# EAGLE design CompPhysMP_V1.0.1 (EAGLE 9.6.2)
2018-03-09: added 4 GPIO block and extender connector
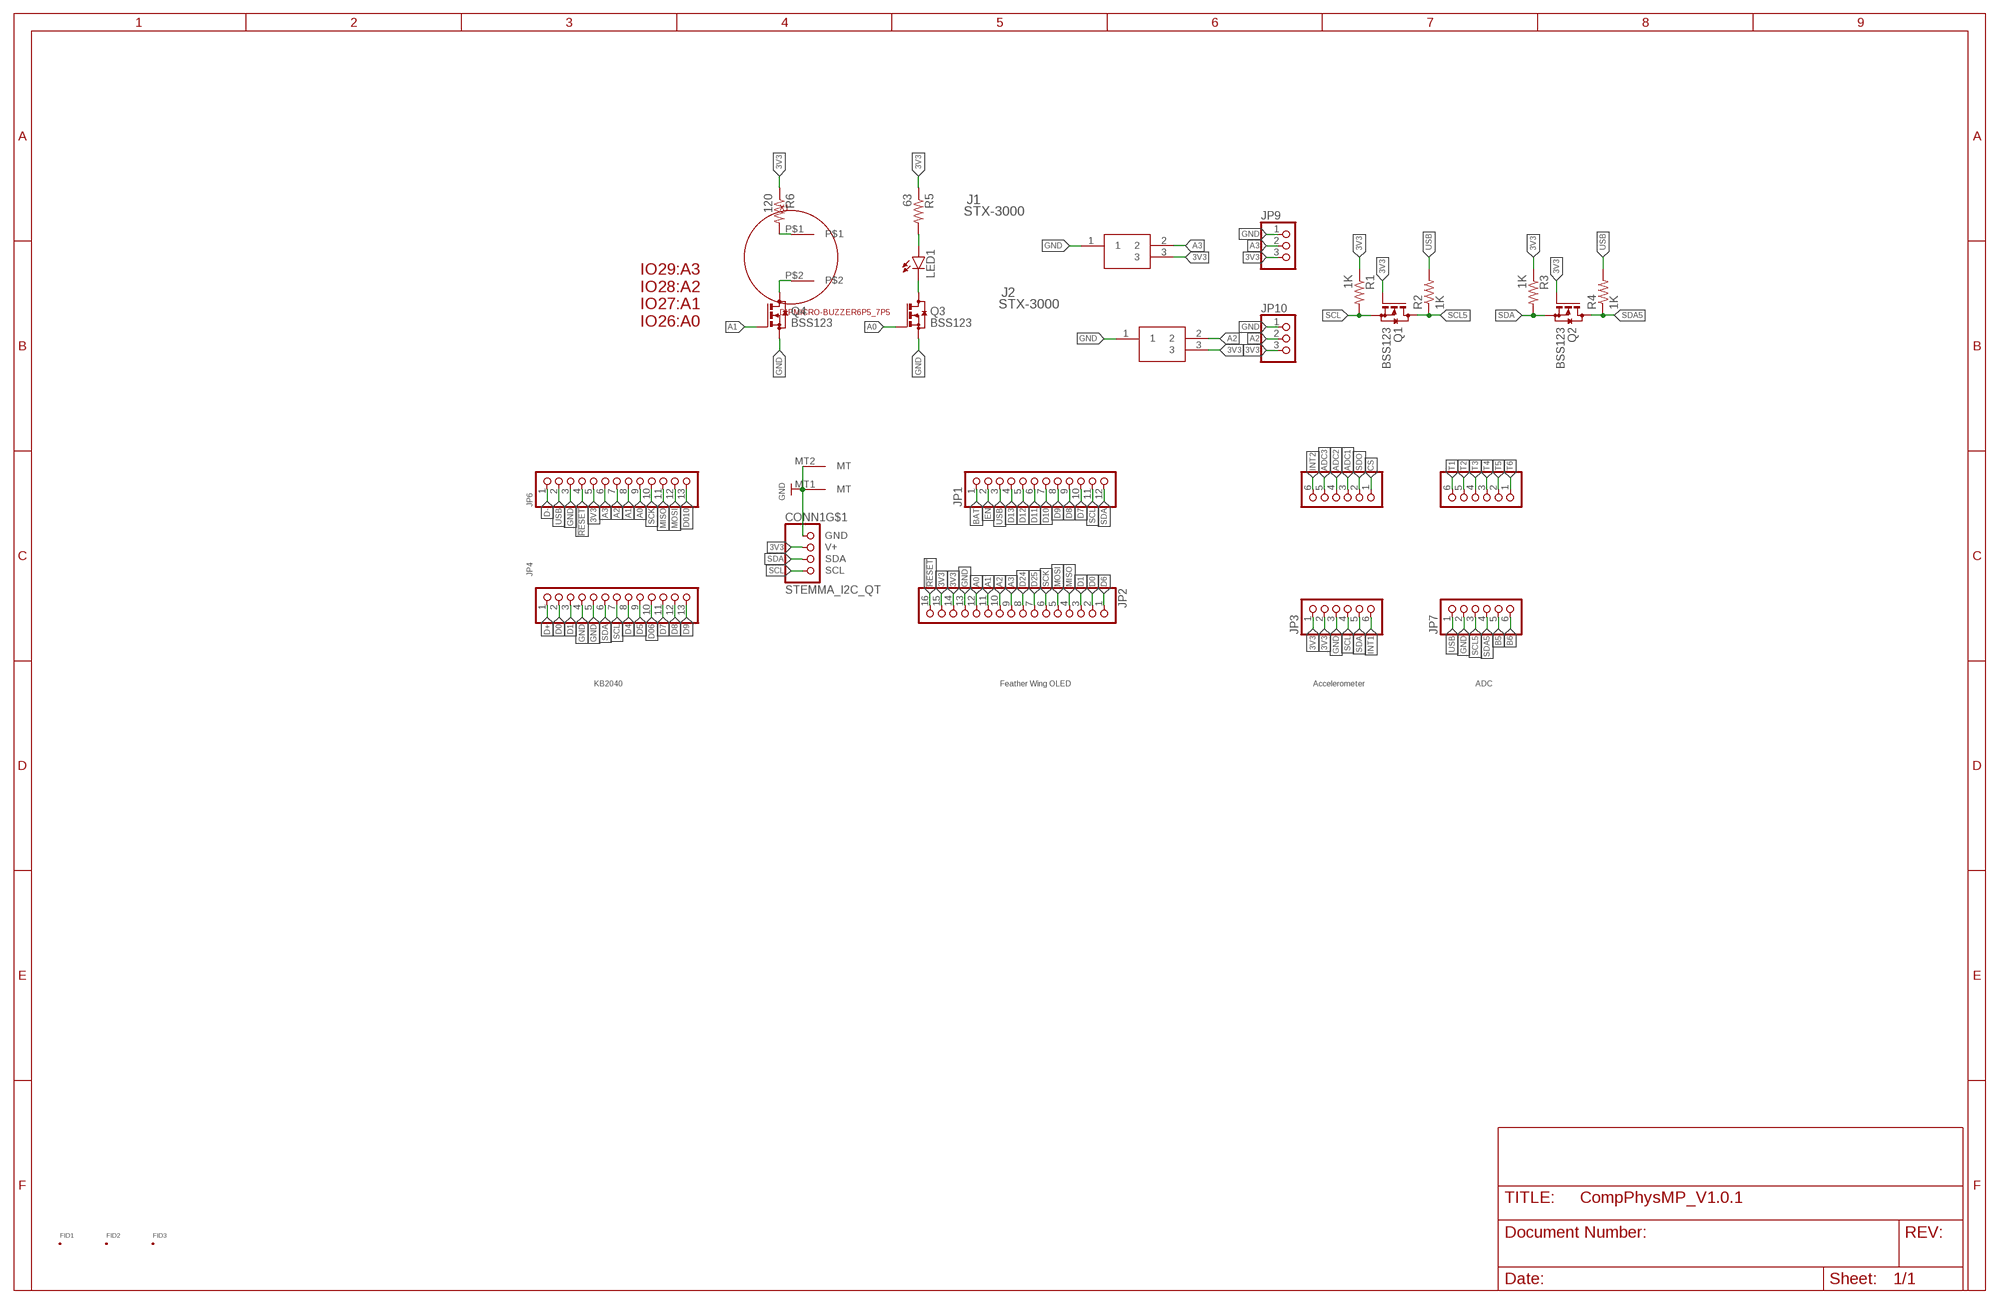
[diagram p0: schematic, sheet 1]

## Parts
CONN1  STEMMA_I2C_QT  [JST_SH4]
FID1  FID_50MIL  [FID_050]
FID2  FID_50MIL  [FID_050]
FID3  FID_50MIL  [FID_050]
J1  STX-3000  [STX3000]
J2  STX-3000  [STX3000]
JP1  PINHD-1X12  [1X12]
JP2  PINHD-1X16  [1X16]
JP3  HEADER-1X670MIL  [1X06_ROUND_70]
JP4  PINHD-1X13  [1X13]
JP5  HEADER-1X670MIL  [1X06_ROUND_70]
JP6  PINHD-1X13  [1X13]
JP7  HEADER-1X670MIL  [1X06_ROUND_70]
JP8  HEADER-1X670MIL  [1X06_ROUND_70]
JP9  PINHD-1X3SMALL-PADS  [1X03-BIG]
JP10  PINHD-1X3SMALL-PADS  [1X03-BIG]
LED1  LED5MM  [LED5MM]
Q1  BSS123  [SOT23]
Q2  BSS123  [SOT23]
Q3  BSS123  [SOT23]
Q4  BSS123  [SOT23]
R1  1K  R-US_R0805  [R0805]
R2  1K  R-US_R0805  [R0805]
R3  1K  R-US_R0805  [R0805]
R4  1K  R-US_R0805  [R0805]
R5  63  R-US_R0805  [R0805]
R6  120  R-US_R0805  [R0805]
X1  DIPMICRO-BUZZER6P5_7P5  [BUZZER-6P5-7P5]

## Nets
3V3 [power]: CONN1.2(V+) J1.3 J2.3 JP2.14 JP2.15 JP3.1 JP3.2 JP6.5 JP9.3 JP10.3 Q1.1(G) Q2.1(G) R1.1 R3.1 R5.1 R6.1
!RESET: JP2.16 JP6.4
A0: JP2.12 JP6.9 Q3.1(G)
A1: JP2.11 JP6.8 Q4.1(G)
A2: J2.2 JP2.10 JP6.7 JP10.2
A3: J1.2 JP2.9 JP6.6 JP9.2
ADC1: JP5.3
ADC2: JP5.4
ADC3: JP5.5
B5: JP7.5
B6: JP7.6
BAT: JP1.1
CS: JP5.1
D0: JP2.2 JP4.2
D1: JP2.3 JP4.3
D4: JP4.8
D5: JP4.9
D6: JP2.1
D06: JP4.10
D7: JP1.10 JP4.11
D8: JP1.9 JP4.12
D9: JP1.8 JP4.13
D10: JP1.7
D010: JP6.13
D11: JP1.6
D12: JP1.5
D13: JP1.4
D24: JP2.8
D25: JP2.7
D+: JP4.1
D-: JP6.1
EN: JP1.2
GND [power]: CONN1.1(GND) CONN1.MT1(MT) CONN1.MT2(MT) J1.1 J2.1 JP2.13 JP3.3 JP4.4 JP4.5 JP6.3 JP7.2 JP9.1 JP10.1 Q3.2(S) Q4.2(S)
INT1: JP3.6
INT2: JP5.6
MISO: JP2.4 JP6.11
MOSI: JP2.5 JP6.12
N$1: LED1.A R5.2
N$2: R6.2 X1.P$1
N$3: LED1.K(C) Q3.3(D)
N$4: Q4.3(D) X1.P$2
SCK: JP2.6 JP6.10
SCL: CONN1.4(SCL) JP1.11 JP3.4 JP4.7 Q1.2(S) R1.2
SCL5: JP7.3 Q1.3(D) R2.1
SDA: CONN1.3(SDA) JP1.12 JP3.5 JP4.6 Q2.2(S) R3.2
SDA5: JP7.4 Q2.3(D) R4.1
SDO: JP5.2
T1: JP8.6
T2: JP8.5
T3: JP8.4
T4: JP8.3
T5: JP8.2
T6: JP8.1
USB: JP1.3 JP6.2 JP7.1 R2.2 R4.2

## Notes on the sheet
- IO29:A3
  IO28:A2
  IO27:A1
  IO26:A0
- KB2040 | Feather Wing OLED | Accelerometer | ADC

## Library data of the parts
CONN1 = microbuilder:STEMMA_I2C
FID1-FID3 = Fiducial:FID: Fiducial marks. Top and Bottom copper with stop mask
J1 J2 = SamacSys_Parts:STX-3000: Phone Connectors 3.5mm PCB STEREO BLK PLASTIC NON THREADED Source: Datasheet <http://www.kycon.com/Pub_Eng_Draw/STX-3000.pdf>; DESCRIPTION: Phone Connectors 3.5mm PCB STEREO BLK PLASTIC NON THREADED; HEIGHT: mm; MANUFACTURER_NAME: Kycon; MANUFACTURER_PART_NUMBER: STX-3000; MOUSER_PART_NUMBER: 806-STX-3000; MOUSER_PRICE-STOCK: https://www.mouser.co.uk/ProductDetail/Kycon/STX-3000?qs=kjZ2mQLP346Nbz1X9BOzfg%3D%3D
JP1 = pinhead:PINHD-1X12: PIN HEADER
JP2 = pinhead:PINHD-1X16: PIN HEADER
JP3 JP5 JP7 JP8 = microbuilder:HEADER-1X6: PIN HEADER
JP4 JP6 = pinhead:PINHD-1X13: PIN HEADER
JP9 JP10 = ICs-new:PINHD-1X3: PIN HEADER
LED1 = led:LED: LED OSRAM: - CHIPLED LG R971, LG N971, LY N971, LG Q971, LY Q971, LO R971, LY R971 LH N974, LH R974 LS Q976, LO Q976, LY Q976 LO Q996 - Hyper CHIPLED LW Q18S LB Q993, LB Q99A, LB R99A - SideLED LS A670, LO A670, LY A670, LG A670, LP A670 LB A673, LV A673, LT A673, LW A673 LH A674 LY A675 LS A676, LA A676, LO A676, LY A676, LW A676 LS A679, LY A679, LG A679 - Hyper Micro SIDELED® LS Y876, LA Y876, LO Y876, LY Y876 LT Y87S - SmartLED LW L88C, LW L88S LB L89C, LB L89S, LG L890 LS L89K, LO L89K, LY L89K LS L896, LA L896, LO L896, LY L896 - TOPLED LS T670, LO T670, LY T670, LG T670, LP T670 LSG T670, LSP T670, LSY T670, LOP T670, LYG T670 LG T671, LOG T671, LSG T671 LB T673, LV T673, LT T673, LW T673 LH T674 LS T676, LA T676, LO T676, LY T676, LB T676, LH T676, LSB T676, LW T676 LB T67C, LV T67C, LT T67C, LS T67K, LO T67K, LY T67K, LW E67C LS E67B, LA E67B, LO E67B, LY E67B, LB E67C, LV E67C, LT E67C LW T67C LS T679, LY T679, LG T679 LS T770, LO T770, LY T770, LG T770, LP T770 LB T773, LV T773, LT T773, LW T773 LH T774 LS E675, LA E675, LY E675, LS T675 LS T776, LA T776, LO T776, LY T776, LB T776 LHGB T686 LT T68C, LB T68C - Hyper Mini TOPLED® LB M676 - Mini TOPLED Santana® LG M470 LS M47K, LO M47K, LY M47K Source: http://www.osram.convergy.de LUXEON: - LUMILED® LXK2-PW12-R00, LXK2-PW12-S00, LXK2-PW14-U00, LXK2-PW14-V00 LXK2-PM12-R00, LXK2-PM12-S00, LXK2-PM14-U00 LXK2-PE12-Q00, LXK2-PE12-R00, LXK2-PE12-S00, LXK2-PE14-T00, LXK2-PE14-U00 LXK2-PB12-K00, LXK2-PB12-L00, LXK2-PB12-M00, LXK2-PB14-N00, LXK2-PB14-P00, LXK2-PB14-Q00 LXK2-PR12-L00, LXK2-PR12-M00, LXK2-PR14-Q00, LXK2-PR14-R00 LXK2-PD12-Q00, LXK2-PD12-R00, LXK2-PD12-S00 LXK2-PH12-R00, LXK2-PH12-S00 LXK2-PL12-P00, LXK2-PL12-Q00, LXK2-PL12-R00 Source: www.luxeon.com KINGBRIGHT: KA-3528ASYC Source: www.kingbright.com
Q1-Q4 = transistor-small-signal:BSS123: N-CHANNEL MOS FET
R1-R6 = rcl:R-US_: RESISTOR, American symbol; SPICEPREFIX: R
X1 = ICs-new:DIPMICRO-BUZZER

## Net classes
0 default: width 0.152 mm, drill 0.203 mm, clearance 0.127 mm
1 power: width 0.305 mm, drill 0.254 mm, clearance 0.127 mm
2 lowpower: width 0.305 mm, drill 0.483 mm

## Board
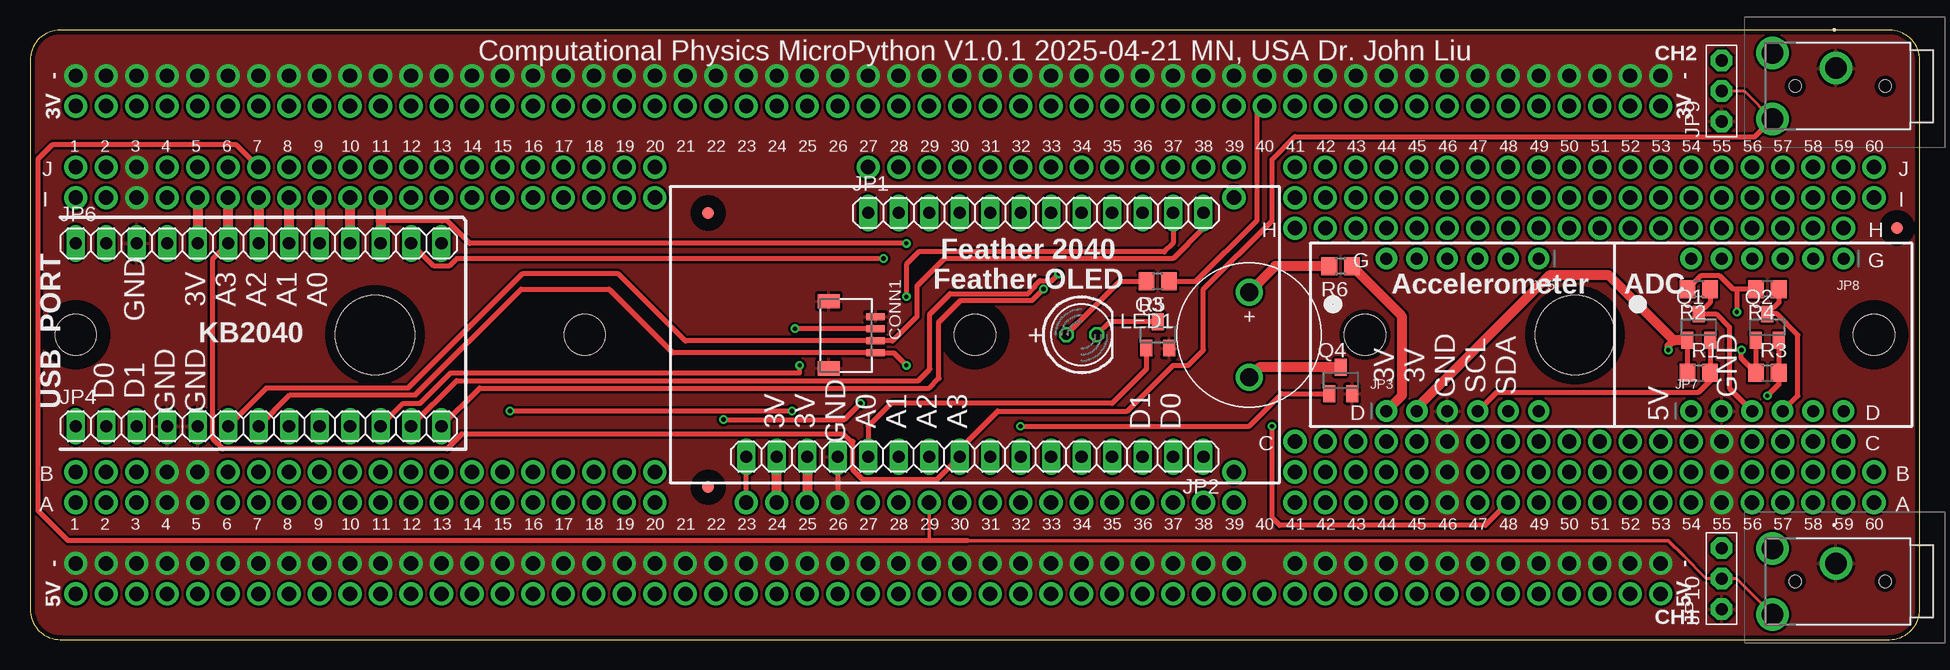
[diagram p1: board, top side]
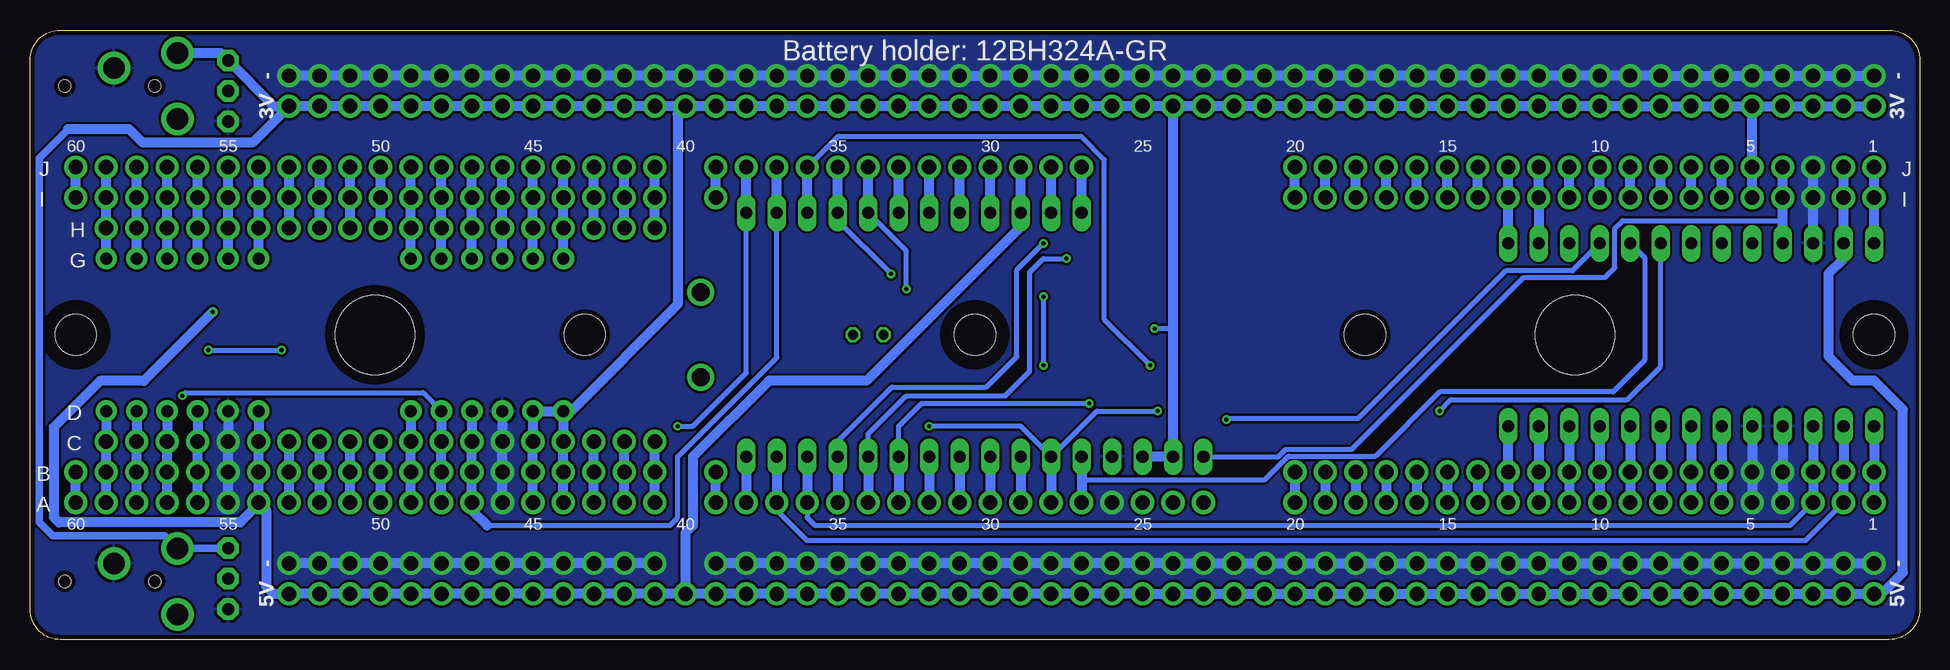
[diagram p2: board, bottom side, seen from below]

Size 157.48 x 50.8 mm. Coordinates in mm from the lower left corner, seen from the top.
Outline: 2.54,50.8 arc90 0,48.26 0,2.54 arc90 2.54,0 154.94,0 arc90 157.48,2.54 157.48,48.26 arc90 154.94,50.8 2.54,50.8
Copper layers (1*16): Top 0.0356mm / dielectric 1.5011mm / Bottom 0.0356mm
Design rules "LaenPCBOrder": minimum track width 6mil, minimum drill 13mil, track to track 6mil, track to pad 6mil, pad to pad 6mil, via to via 6mil, smd to smd 6mil, copper to edge 15mil, drill to drill 6mil, minimum pad ring 7mil, minimum via ring 7mil, stop-mask expansion 3mil, vias tented up to drill 0mil, thermal gap 10mil
Holes 3.43 mm at 3.81,25.4 153.67,25.4 78.74,25.4 111.25,25.4 46.23,25.4
Holes 6.6 mm at 128.74,25.4 28.74,25.4
tRestrict: area 1.3,22.9 to 6.3,27.9; area 151.1,22.9 to 156.2,27.9; area 76.2,22.9 to 81.3,27.9; area 124.9,21.6 to 132.5,29.2; area 24.9,21.6 to 32.6,29.2
bRestrict: area 151.1,22.9 to 156.2,27.9; area 1.3,22.9 to 6.3,27.9; area 76.2,22.9 to 81.3,27.9; area 124.9,21.6 to 132.5,29.2; area 24.9,21.6 to 32.6,29.2

### Footprints (pad centres in the part's own frame; a part is rotated, then mirrored left to right if it is on the bottom)
JST_SH4 = smd 0.6 x 1.55: 1 -1.5,2.514; 2 -0.5,2.514; 3 0.5,2.514; 4 1.5,2.514 | smd 1.2 x 1.8: MT1 -2.8,-1.386; MT2 2.8,-1.386
FID_050 = smd 1.016 x 1.016: FIDT 0,0
STX3000 = drill 1.803 pad 2.704: 1 0,0; 2 5.3,4.25; 3 5.3,-1.25 | hole 1: -4.1,1.5; 3.4,1.5
1X12 = drill 1.016 long: 1 -13.97,0; 2 -11.43,0; 3 -8.89,0; 4 -6.35,0; 5 -3.81,0; 6 -1.27,0; 7 1.27,0; 8 3.81,0; 9 6.35,0; 10 8.89,0; 11 11.43,0; 12 13.97,0
1X16 = drill 1.016 long: 1 -19.05,0; 2 -16.51,0; 3 -13.97,0; 4 -11.43,0; 5 -8.89,0; 6 -6.35,0; 7 -3.81,0; 8 -1.27,0; 9 1.27,0; 10 3.81,0; 11 6.35,0; 12 8.89,0; 13 11.43,0; 14 13.97,0; 15 16.51,0; 16 19.05,0
1X06_ROUND_70 = drill 1 pad 1.778: 1 -6.35,0; 2 -3.81,0; 3 -1.27,0; 4 1.27,0; 5 3.81,0; 6 6.35,0
1X13 = drill 1.016 long: 1 -15.24,0; 2 -12.7,0; 3 -10.16,0; 4 -7.62,0; 5 -5.08,0; 6 -2.54,0; 7 0,0; 8 2.54,0; 9 5.08,0; 10 7.62,0; 11 10.16,0; 12 12.7,0; 13 15.24,0
1X03-BIG = drill 1.016 pad 1.778 octagon: 1 -2.54,0; 2 0,0; 3 2.54,0
LED5MM = drill 0.813 octagon: A -1.27,0; K 1.27,0
SOT23 = smd 1 x 1.4: 1 -0.95,-1.1; 2 0.95,-1.1; 3 0,1.1
R0805 = smd 1.3 x 1.5: 1 -0.95,0; 2 0.95,0
BUZZER-6P5-7P5 = drill 1.5: P$1 0,3.55; P$2 0,-3.55

### Placement (x,y rotation side)
CONN1  67.94,25.4 270 top
FID1  56.51,12.7 0 top
FID2  155.57,34.29 0 top
FID3  56.51,35.56 0 top
J1  150.5,47.62 180 top
J2  150.5,6.35 180 top
JP1  83.82,35.56 0 top
JP2  78.74,15.24 180 top
JP3  119.38,19.05 0 top
JP4  19.05,17.78 0 top
JP5  119.38,31.75 180 top
JP6  19.05,33.02 0 top
JP7  144.78,19.05 0 top
JP8  144.78,31.75 180 top
JP9  140.97,45.72 90 top
JP10  140.97,5.08 90 top
LED1  87.63,25.4 0 top
Q1  139.06,26.04 0 top
Q2  144.78,26.04 0 top
Q3  93.98,25.4 0 top
Q4  109.22,21.59 0 top
R1  139.06,22.22 0 top
R2  139.06,29.21 180 top
R3  144.78,22.22 0 top
R4  144.78,29.21 180 top
R5  93.98,29.84 180 top
R6  109.22,31.11 180 top
X1  101.6,25.4 0 top

### Tracks (layer width: path | path; a pad name or v marks a point on that pad's centre or on a via)
3V3  (via drill 0.35, 1.2 pad 1.93)
  Top 0.406: Q2.1 R3.1 142.62,23.43 v142.62,24.13 | Q1.1 R1.1 | v102.87,44.45 102.23,43.81 102.23,34.92 97.16,29.84 R5.1 | v63.75,25.91 63.76,25.9 CONN1.2
  Top 0.61: v136.52,24.13 136.52,24.47 136.99,24.93
  Top 0.813: JP3.2 115.57,19.3 126.62,30.35 131.57,30.35 136.99,24.93 Q1.1 | JP2.14 v64.77,11.43 | v62.23,11.43 JP2.15 | v13.97,36.83 JP6.5 | R6.1 114.3,26.98 114.3,20.32 JP3.1
  Bottom 0.406: v142.62,24.13 v136.52,24.13 | 62.23,25.91 v63.75,25.91
  Bottom 0.61: 154.31,42.55 156.72,40.13 156.72,9.78 155.6,8.66 146.26,8.66 J2.3 145.18,7.62 JP10.3
  Bottom 0.813: v113.03,11.43 v113.03,13.97 v113.03,16.51 JP3.1 | v13.97,36.83 v13.97,39.37 v13.97,44.45 | v62.23,44.45 v64.77,44.45 v67.31,44.45 v69.85,44.45 v72.39,44.45 v74.93,44.45 v77.47,44.45 v80.01,44.45 v82.55,44.45 v85.09,44.45 v87.63,44.45 v90.17,44.45 v92.71,44.45 v95.25,44.45 v97.79,44.45 v100.33,44.45 v102.87,44.45 | v62.23,44.45 v59.69,44.45 v57.15,44.45 v54.61,44.45 v52.07,44.45 v49.53,44.45 v46.99,44.45 v44.45,44.45 v41.91,44.45 v39.37,44.45 v36.83,44.45 v34.29,44.45 v31.75,44.45 v29.21,44.45 v26.67,44.45 v24.13,44.45 v21.59,44.45 v19.05,44.45 v16.51,44.45 v13.97,44.45 | v3.81,44.45 v6.35,44.45 v8.89,44.45 v11.43,44.45 v13.97,44.45 | v135.89,44.45 v133.35,44.45 v130.81,44.45 v128.27,44.45 v125.73,44.45 v123.19,44.45 v120.65,44.45 v118.11,44.45 v115.57,44.45 v113.03,44.45 v110.49,44.45 v107.95,44.45 v105.41,44.45 v102.87,44.45 | v115.57,11.43 v115.57,13.97 v115.57,16.51 JP3.2 JP3.1 | JP2.14 JP2.15 62.23,25.91 v62.23,44.45 | JP3.1 112.39,19.05 103.5,27.94 103.5,43.81 v102.87,44.45 | 154.31,42.55 149.22,42.55 148.14,41.46 138.88,41.46 v135.89,44.45 | J1.3 141.58,48.88 JP9.3 137.16,44.45 v135.89,44.45
!RESET  (via drill 1.2 pad 1.93)
  Top 0.406: v59.69,11.43 JP2.16
  Bottom 0.406: JP2.16 53.46,15.24 52.85,15.85 47.32,15.85 32.99,30.17 26.21,30.17 25.4,30.99 25.4,34.29 24.76,34.92 11.43,34.92
  Bottom 0.813: JP6.4 11.43,34.92 v11.43,36.83 v11.43,39.37
A0  (via drill 1.2 pad 1.93)
  Top 0.406: Q3.1 93.03,22.54 90.17,19.68 71.75,19.68 69.85,17.78 JP2.12
  Top 0.813: v24.13,36.83 JP6.9
  Bottom 0.406: JP2.12 69.85,13.33 54.57,13.33 52.62,15.29 45.34,15.29 39.98,20.65 25.55,20.65 22.94,23.26 22.94,31.83 JP6.9
  Bottom 0.813: v24.13,36.83 v24.13,39.37 | JP2.12 v69.85,11.43
A1  (via drill 0.35, 1.2 pad 1.93)
  Top 0.406: v63.5,19.05 v40,19.05 | Q4.1 104.31,20.49 101.6,17.78 v82.55,17.78
  Top 0.813: JP6.8 v21.59,36.83
  Bottom 0.406: v63.5,19.05 68.58,19.05 JP2.11 74.93,17.78 v82.55,17.78 | v40,19.05 39.06,19.99 24.36,19.99 21.59,22.76 JP6.8
  Bottom 0.813: v21.59,36.83 v21.59,39.37 | JP2.11 v72.39,11.43
A2  (via drill 1.2 pad 1.93)
  Top 0.254: J2.2 142.22,5.08 JP10.2 139.7,5.08 137.79,6.98
  Top 0.305: v74.93,11.43 74.93,8.25 | 137.79,6.98 136.52,8.25 78.1,8.25
  Top 0.406: 78.1,8.25 74.93,8.25 3.17,8.25 0.69,10.74 0.69,40.06 1.91,41.27 17.14,41.27 v19.05,39.37
  Top 0.813: v19.05,36.83 JP6.7
  Bottom 0.813: v19.05,36.83 v19.05,39.37 | JP2.10 v74.93,11.43
A3  (via drill 1.2 pad 1.93)
  Top 0.254: JP9.2 142.85,45.72 J1.2
  Top 0.406: JP6.6 15.24,31.75 15.24,16.71 16.05,15.9 34.75,15.9 35.97,17.12 67.77,17.12 68.38,16.51 68.58,16.51 68.58,14.17 69.41,13.33 75.56,13.33 JP2.9 77.47,15.87 80.64,19.05 91.44,19.05 95.25,22.86 96.52,22.86 97.79,24.13 97.79,29.21 103.5,34.92 103.5,40 105.41,41.91 143.73,41.91 J1.2
  Top 0.813: JP6.6 v16.51,36.83
  Bottom 0.813: v16.51,36.83 v16.51,39.37 | JP2.9 v77.47,11.43
ADC1  (via drill 1.2 pad 1.93)
  Bottom 0.813: v120.65,39.37 v120.65,36.83 v120.65,34.29 JP5.3
ADC2  (via drill 1.2 pad 1.93)
  Bottom 0.813: v118.11,39.37 v118.11,36.83 v118.11,34.29 JP5.4
ADC3  (via drill 1.2 pad 1.93)
  Bottom 0.813: v115.57,39.37 v115.57,36.83 v115.57,34.29 JP5.5
B5  (via drill 1.2 pad 1.93)
  Bottom 0.813: v148.59,11.43 v148.59,13.97 v148.59,16.51 JP7.5
B6  (via drill 1.2 pad 1.93)
  Bottom 0.813: v151.13,11.43 v151.13,13.97 v151.13,16.51 JP7.6
BAT  (via drill 1.2 pad 1.93)
  Bottom 0.813: JP1.1 v69.85,39.37
CS  (via drill 1.2 pad 1.93)
  Bottom 0.813: v125.73,39.37 v125.73,36.83 v125.73,34.29 JP5.1
D0  (via drill 1.2 pad 1.93)
  Bottom 0.406: v6.35,11.43 9.52,8.25 92.71,8.25 95.25,10.79 v95.25,11.43
  Bottom 0.813: JP4.2 v6.35,13.97 v6.35,11.43 | JP2.2 v95.25,11.43
D1  (via drill 1.2 pad 1.93)
  Bottom 0.406: v92.71,11.43 92.71,10.16 92.07,9.52 10.8,9.52 v8.89,11.43
  Bottom 0.813: JP4.3 v8.89,13.97 v8.89,11.43 | JP2.3 v92.71,11.43
D4  (via drill 1.2 pad 1.93)
  Bottom 0.813: JP4.8 v21.59,13.97 v21.59,11.43
D5  (via drill 1.2 pad 1.93)
  Bottom 0.813: JP4.9 v24.13,13.97 v24.13,11.43
D6  (via drill 1.2 pad 1.93)
  Bottom 0.813: JP2.1 v97.79,11.43
D06  (via drill 1.2 pad 1.93)
  Bottom 0.813: JP4.10 v26.67,13.97 v26.67,11.43
D7  (via drill 0.35, 1.2 pad 1.93)
  Top 0.406: JP4.11 31.11,19.68 32.51,19.68 35.05,22.22 64.13,22.22 v64.13,22.86
  Bottom 0.406: v64.13,22.86 67.94,26.67 67.94,40 69.85,41.91 90.17,41.91 v92.71,39.37
  Bottom 0.813: JP4.11 v29.21,13.97 v29.21,11.43 | JP1.10 v92.71,39.37
D8  (via drill 0.35, 1.2 pad 1.93)
  Top 0.406: JP4.12 35.56,21.59 74.04,21.59 74.98,22.53 74.98,27.12 76.68,28.83 83.19,28.83 83.75,29.39 83.75,29.5 84.16,29.92 85.16,29.92 v85.72,30.48
  Bottom 0.406: v85.72,30.48 90.17,34.92 JP1.9
  Bottom 0.813: JP4.12 v31.75,13.97 v31.75,11.43 | JP1.9 v90.17,39.37
D9  (via drill 0.35, 1.2 pad 1.93)
  Top 0.406: JP4.13 37.46,20.95 74.93,20.95 75.74,21.77 75.74,26.46 77.55,28.27 83.52,28.27 v84.45,29.21
  Bottom 0.406: v84.45,29.21 84.45,32.38 JP1.8
  Bottom 0.813: JP4.13 v34.29,13.97 v34.29,11.43 | JP1.8 v87.63,39.37
D10  (via drill 1.2 pad 1.93)
  Bottom 0.813: JP1.7 v85.09,39.37
D010  (via drill 1.2 pad 1.93)
  Bottom 0.813: v34.29,39.37 v34.29,36.83 JP6.13
D11  (via drill 1.2 pad 1.93)
  Bottom 0.813: JP1.6 v82.55,39.37
D12  (via drill 1.2 pad 1.93)
  Bottom 0.813: JP1.5 v80.01,39.37
D13  (via drill 1.2 pad 1.93)
  Bottom 0.813: JP1.4 v77.47,39.37
D24  (via drill 1.2 pad 1.93)
  Bottom 0.813: JP2.8 v80.01,11.43
D25  (via drill 1.2 pad 1.93)
  Bottom 0.813: JP2.7 v82.55,11.43
D+  (via drill 1.2 pad 1.93)
  Bottom 0.813: JP4.1 v3.81,13.97 v3.81,11.43
D-  (via drill 1.2 pad 1.93)
  Bottom 0.813: JP6.1 v3.81,36.83 v3.81,39.37
EN  (via drill 1.2 pad 1.93)
  Bottom 0.813: JP1.2 v72.39,39.37
GND  (via drill 1.2 pad 1.93)
  Top 0.406: JP2.13 v67.31,11.43
  Bottom 0.813: JP4.4 v11.43,13.97 v11.43,11.43 | JP6.3 v8.89,36.83 v8.89,39.37 | JP4.5 v13.97,13.97 v13.97,11.43 | v3.81,6.35 v6.35,6.35 v8.89,6.35 v11.43,6.35 v13.97,6.35 v16.51,6.35 v19.05,6.35 v21.59,6.35 v24.13,6.35 v26.67,6.35 v29.21,6.35 v31.75,6.35 v34.29,6.35 v36.83,6.35 v39.37,6.35 v41.91,6.35 v44.45,6.35 v46.99,6.35 v49.53,6.35 v52.07,6.35 v54.61,6.35 v57.15,6.35 v59.69,6.35 v62.23,6.35 v64.77,6.35 v67.31,6.35 v69.85,6.35 v72.39,6.35 v74.93,6.35 v77.47,6.35 v80.01,6.35 80.52,6.35 | 80.52,6.35 v82.55,6.35 v85.09,6.35 v87.63,6.35 v90.17,6.35 v92.71,6.35 v95.25,6.35 v97.79,6.35 v100.33,6.35 | v105.41,6.35 v107.95,6.35 v110.49,6.35 v113.03,6.35 v115.57,6.35 v118.11,6.35 v120.65,6.35 v123.19,6.35 v125.73,6.35 v128.27,6.35 v130.81,6.35 v133.35,6.35 v135.89,6.35 | 80.52,6.35 80.52,6.1 | v3.81,46.99 v6.35,46.99 v8.89,46.99 v11.43,46.99 v13.97,46.99 v16.51,46.99 v19.05,46.99 v21.59,46.99 v24.13,46.99 v26.67,46.99 v29.21,46.99 v31.75,46.99 v34.29,46.99 v36.83,46.99 v39.37,46.99 v41.91,46.99 v44.45,46.99 v46.99,46.99 v49.53,46.99 v52.07,46.99 v54.61,46.99 v57.15,46.99 v59.69,46.99 v62.23,46.99 v64.77,46.99 v67.31,46.99 v69.85,46.99 v72.39,46.99 v74.93,46.99 v77.47,46.99 v80.01,46.99 v82.55,46.99 v85.09,46.99 v87.63,46.99 v90.17,46.99 v92.71,46.99 v95.25,46.99 v97.79,46.99 v100.33,46.99 v102.87,46.99 v105.41,46.99 v107.95,46.99 v110.49,46.99 v113.03,46.99 v115.57,46.99 v118.11,46.99 v120.65,46.99 v123.19,46.99 v125.73,46.99 v128.27,46.99 v130.81,46.99 v133.35,46.99 v135.89,46.99 | v118.11,11.43 v118.11,13.97 v118.11,16.51 JP3.3
  Bottom 0.813: v140.97,11.43 v140.97,13.97 v140.97,16.51 JP7.2
  pour Bottom (isolate 0.203): -0.95,-1.59 158.43,-1.59 158.43,51.75 -0.95,51.75
  pour Top (isolate 0.203): -0.32,-0.95 157.8,-0.95 157.8,51.12 -0.32,51.12
INT1  (via drill 1.2 pad 1.93)
  Bottom 0.813: v125.73,11.43 v125.73,13.97 v125.73,16.51 JP3.6
INT2  (via drill 1.2 pad 1.93)
  Bottom 0.813: v113.03,39.37 v113.03,36.83 v113.03,34.29 JP5.6
MISO  (via drill 0.35, 1.2 pad 1.93)
  Top 0.406: v73.02,33.02 36.63,33.02 34.75,34.9 34.31,34.9 34.29,34.92 29.21,34.92
  Top 0.813: v29.21,36.83 29.21,34.92 JP6.11
  Bottom 0.406: JP2.4 90.17,16.51 85.65,21.03 77.78,21.03 75.23,23.58 75.23,30.81 v73.02,33.02
  Bottom 0.813: v29.21,36.83 v29.21,39.37 | JP2.4 v90.17,11.43
MOSI  (via drill 0.35, 1.2 pad 1.93)
  Top 0.406: v71.12,31.75 35.56,31.75 34.92,31.11 33.65,31.11 JP6.12
  Bottom 0.406: JP2.5 87.63,17.14 84.45,20.32 76.2,20.32 74.17,22.35 74.17,30.61 73.02,31.75 v71.12,31.75
  Bottom 0.813: v31.75,39.37 v31.75,36.83 JP6.12 | JP2.5 v87.63,11.43
N$1
  Top 0.406: LED1.A 90.8,29.84 R5.2
N$2
  Top 0.813: R6.2 103.76,31.11 X1.P$1
N$3
  Top 0.406: Q3.3 90,26.5 LED1.K
N$4
  Top 0.813: Q4.3 102.44,22.69 X1.P$2
N$13  (via drill 1.2 pad 1.93)
  Bottom 0.813: v49.53,36.83 v49.53,39.37
N$15  (via drill 1.2 pad 1.93)
  Bottom 0.813: v36.83,13.97 v36.83,11.43
N$16  (via drill 1.2 pad 1.93)
  Bottom 0.813: v39.37,13.97 v39.37,11.43
N$17  (via drill 1.2 pad 1.93)
  Bottom 0.813: v41.91,13.97 v41.91,11.43
N$18  (via drill 1.2 pad 1.93)
  Bottom 0.813: v46.99,13.97 v46.99,11.43
N$19  (via drill 1.2 pad 1.93)
  Bottom 0.813: v44.45,13.97 v44.45,11.43
N$20  (via drill 1.2 pad 1.93)
  Bottom 0.813: v49.53,13.97 v49.53,11.43
N$21  (via drill 1.2 pad 1.93)
  Bottom 0.813: v52.07,13.97 v52.07,11.43
N$24  (via drill 1.2 pad 1.93)
  Bottom 0.813: v44.45,36.83 v44.45,39.37
N$26  (via drill 1.2 pad 1.93)
  Bottom 0.813: v41.91,36.83 v41.91,39.37
N$30  (via drill 1.2 pad 1.93)
  Bottom 0.813: v36.83,36.83 v36.83,39.37
N$44  (via drill 1.2 pad 1.93)
  Bottom 0.813: v52.07,36.83 v52.07,39.37
N$46  (via drill 1.2 pad 1.93)
  Bottom 0.813: v46.99,36.83 v46.99,39.37
N$49  (via drill 1.2 pad 1.93)
  Bottom 0.813: v39.37,36.83 v39.37,39.37
N$65  (via drill 1.2 pad 1.93)
  Bottom 0.813: v100.33,36.83 v100.33,39.37
N$74  (via drill 1.2 pad 1.93)
  Bottom 0.813: v100.33,11.43 v100.33,13.97
N$76  (via drill 1.2 pad 1.93)
  Bottom 0.813: v105.41,16.51 v105.41,13.97 v105.41,11.43
N$77  (via drill 1.2 pad 1.93)
  Bottom 0.813: v107.95,11.43 v107.95,13.97 v107.95,16.51
N$78  (via drill 1.2 pad 1.93)
  Bottom 0.813: v110.49,16.51 v110.49,13.97 v110.49,11.43
N$85  (via drill 1.2 pad 1.93)
  Bottom 0.813: v128.27,11.43 v128.27,13.97 v128.27,16.51
N$86  (via drill 1.2 pad 1.93)
  Bottom 0.813: v133.35,11.43 v133.35,13.97 v133.35,16.51
N$87  (via drill 1.2 pad 1.93)
  Bottom 0.813: v130.81,16.51 v130.81,13.97 v130.81,11.43
N$88  (via drill 1.2 pad 1.93)
  Bottom 0.813: v135.89,16.51 v135.89,13.97 v135.89,11.43
N$95  (via drill 1.2 pad 1.93)
  Bottom 0.813: v153.67,11.43 v153.67,13.97
N$97  (via drill 1.2 pad 1.93)
  Bottom 0.813: v153.67,36.83 v153.67,39.37
N$103  (via drill 1.2 pad 1.93)
  Bottom 0.813: v135.89,39.37 v135.89,36.83 v135.89,34.29
N$105  (via drill 1.2 pad 1.93)
  Bottom 0.813: v133.35,39.37 v133.35,36.83 v133.35,34.29
N$106  (via drill 1.2 pad 1.93)
  Bottom 0.813: v130.81,39.37 v130.81,36.83 v130.81,34.29
N$107  (via drill 1.2 pad 1.93)
  Bottom 0.813: v128.27,34.29 v128.27,36.83 v128.27,39.37
N$113  (via drill 1.2 pad 1.93)
  Bottom 0.813: v110.49,34.29 v110.49,36.83 v110.49,39.37
N$115  (via drill 1.2 pad 1.93)
  Bottom 0.813: v107.95,39.37 v107.95,36.83 v107.95,34.29
N$116  (via drill 1.2 pad 1.93)
  Bottom 0.813: v105.41,39.37 v105.41,36.83 v105.41,34.29
SCK  (via drill 0.35, 1.2 pad 1.93)
  Top 0.406: v57.78,18.34 67.87,18.34 v69.21,19.68
  Top 0.813: JP6.10 v26.67,36.83
  Bottom 0.406: JP2.6 85.09,17.78 83.19,19.68 v69.21,19.68 | JP6.10 28.96,30.73 34.5,30.73 46.82,18.41 57.78,18.41 v57.78,18.34
  Bottom 0.813: v26.67,36.83 v26.67,39.37 | JP2.6 v85.09,11.43
SCL  (via drill 0.35, 1.2 pad 1.93)
  Top 0.406: Q1.2 R1.2 140.01,21.59 139,20.57 122.17,20.57 JP3.4 | JP4.7 21.67,20.4 32.11,20.4 40.92,29.21 48.26,29.21 53.57,23.9 CONN1.4 70.44,23.88 72.01,23.88 v73.02,22.86 | JP1.11 95.25,33.02 94.54,32.31 74.06,32.31 73.02,31.27 v73.02,28.57
  Bottom 0.406: 119.38,9.52 104.14,9.52 103.5,10.16 103.5,15.24 95.25,23.49 JP1.11 | v73.02,28.57 v73.02,22.86
  Bottom 0.813: JP3.4 v120.65,16.51 v120.65,13.97 v120.65,11.43 120.65,10.79 119.38,9.52 | JP4.7 v19.05,13.97 v19.05,11.43 | JP1.11 v95.25,39.37
SCL5  (via drill 1.2 pad 1.93)
  Top 0.406: R2.1 140.01,28.08 Q1.3 140.5,27.13 141.6,26.04 141.6,20.95 JP7.3
  Bottom 0.813: v143.51,11.43 v143.51,13.97 v143.51,16.51 JP7.3
SDA  (via drill 0.35, 1.2 pad 1.93)
  Top 0.406: Q2.2 R3.2 145.73,21.27 v144.78,20.32 | v123.19,11.43 121.28,9.52 104.14,9.52 103.5,10.16 v103.5,17.78 | JP1.12 97.79,34.29 95.25,31.75 76.2,31.75 73.91,29.46 73.91,26.92 71.89,24.9 CONN1.3 54.61,24.9 49.03,30.48 41.02,30.48 31.5,20.95 19.68,20.95 JP4.6
  Bottom 0.406: v144.78,20.32 144.53,20.57 124.71,20.57 JP3.5 | v103.5,17.78 102.23,17.78 97.79,22.22 JP1.12
  Bottom 0.813: v123.19,11.43 v123.19,13.97 v123.19,16.51 JP3.5 | JP4.6 v16.51,13.97 v16.51,11.43 | JP1.12 v97.79,39.37
SDA5  (via drill 1.2 pad 1.93)
  Top 0.406: JP7.4 147.32,20.32 147.32,25.4 145.58,27.13 Q2.3 145.73,28.08 R4.1
  Bottom 0.813: v146.05,11.43 v146.05,13.97 v146.05,16.51 JP7.4
SDO  (via drill 1.2 pad 1.93)
  Bottom 0.813: v123.19,39.37 v123.19,36.83 v123.19,34.29 JP5.2
T1  (via drill 1.2 pad 1.93)
  Bottom 0.813: v138.43,39.37 v138.43,36.83 v138.43,34.29 JP8.6
T2  (via drill 1.2 pad 1.93)
  Bottom 0.813: v140.97,39.37 v140.97,36.83 v140.97,34.29 JP8.5
T3  (via drill 1.2 pad 1.93)
  Bottom 0.813: v143.51,39.37 v143.51,36.83 v143.51,34.29 JP8.4
T4  (via drill 1.2 pad 1.93)
  Bottom 0.813: v146.05,39.37 v146.05,36.83 v146.05,34.29 JP8.3
T5  (via drill 1.2 pad 1.93)
  Bottom 0.813: v148.59,39.37 v148.59,36.83 v148.59,34.29 JP8.2
T6  (via drill 1.2 pad 1.93)
  Bottom 0.813: v151.13,39.37 v151.13,36.83 v151.13,34.29 JP8.1
USB  (via drill 0.35, 1.2 pad 1.93)
  Top 0.406: R4.2 142.24,29.21 | 142.24,29.21 141.92,29.21 140.81,30.32 139.22,30.32 139.01,30.11 139.01,30.1 R2.2 | 142.24,29.21 v142.24,27.3
  Bottom 0.813: v74.93,39.37 JP1.3 74.93,34.42 87.76,21.59 95.88,21.59 102.23,15.24 102.23,9.52 102.87,8.89 v102.87,3.81 | v138.43,11.43 v138.43,13.97 v138.43,16.51 JP7.1 | v6.35,39.37 v6.35,36.83 JP6.2 6.35,31.75 7.62,30.48 7.62,23.62 5.59,21.59 3.81,21.59 1.4,19.18 1.4,5.59 3.17,3.81 v3.81,3.81 v6.35,3.81 v8.89,3.81 v11.43,3.81 v13.97,3.81 v16.51,3.81 v19.05,3.81 v21.59,3.81 v24.13,3.81 v26.67,3.81 v29.21,3.81 v31.75,3.81 v34.29,3.81 v36.83,3.81 v39.37,3.81 v41.91,3.81 v44.45,3.81 v46.99,3.81 v49.53,3.81 v52.07,3.81 v54.61,3.81 v57.15,3.81 v59.69,3.81 v62.23,3.81 v64.77,3.81 v67.31,3.81 v69.85,3.81 v72.39,3.81 v74.93,3.81 v77.47,3.81 v80.01,3.81 v82.55,3.81 v85.09,3.81 v87.63,3.81 v90.17,3.81 v92.71,3.81 v95.25,3.81 v97.79,3.81 v100.33,3.81 v102.87,3.81 | v102.87,3.81 v105.41,3.81 v107.95,3.81 v110.49,3.81 v113.03,3.81 v115.57,3.81 v118.11,3.81 v120.65,3.81 v123.19,3.81 v125.73,3.81 v128.27,3.81 v130.81,3.81 v133.35,3.81 v135.89,3.81 137.16,3.81 137.79,4.45 137.79,10.79 v138.43,11.43 | v142.24,27.3 147.98,21.56 151.65,21.56 155.5,17.71 155.5,10.21 155.07,9.78 139.95,9.78 138.43,11.3 v138.43,11.43

### Text on the board
tPlace: Computational Physics MicroPython V1.0.1 2025-04-21 MN, USA Dr. John Liu | CH2 | - | - | 3V | 3V | 1 | 2 | 3 | 4 | 5 | 6 | 7 | 8 | 9 | 10 | 11 | 12 | 13 | 14 | 15 | 16 | 17 | 18 | 19 | 20 | 21 | 22 | 23 | 24 | 25 | 26 | 27 | 28 | 29 | 30 | 31 | 32 | 33 | 34 | 35 | 36 | 37 | 38 | 39 | 40 | 41 | 42 | 43 | 44 | 45 | 46 | 47 | 48 | 49 | 50 | 51 | 52 | 53 | 54 | 55 | 56 | 57 | 58 | 59 | 60 | J | J | I | I | H | H | G | G | GND | 3V | A3 | A2 | A1 | A0 | Feather 2040 / Feather OLED | Accelerometer | ADC | USB PORT | + | KB2040 | 3V | 3V | GND | SCL | SDA | GND | D0 | D1 | GND | GND | 3V | 3V | GND | A0 | A1 | A2 | A3 | D1 | D0 | 5V | D | D | C | C | B | B | A | A | 1 | 2 | 3 | 4 | 5 | 6 | 7 | 8 | 9 | 10 | 11 | 12 | 13 | 14 | 15 | 16 | 17 | 18 | 19 | 20 | 21 | 22 | 23 | 24 | 25 | 26 | 27 | 28 | 29 | 30 | 31 | 32 | 33 | 34 | 35 | 36 | 37 | 38 | 39 | 40 | 41 | 42 | 43 | 44 | 45 | 46 | 47 | 48 | 49 | 50 | 51 | 52 | 53 | 54 | 55 | 56 | 57 | 58 | 59 | 60 | - | - | 5V | 5V | CH1
bPlace: Battery holder: 12BH324A-GR | - | - | 3V | 3V | 1 | 5 | 10 | 15 | 20 | 25 | 30 | 35 | 40 | 45 | 50 | 55 | 60 | J | J | I | I | H | G | D | C | B | A | 1 | 5 | 10 | 15 | 20 | 25 | 30 | 35 | 40 | 45 | 50 | 55 | 60 | - | - | 5V | 5V